# EAGLE schematic project_full_hardware (EAGLE 8.2.1)
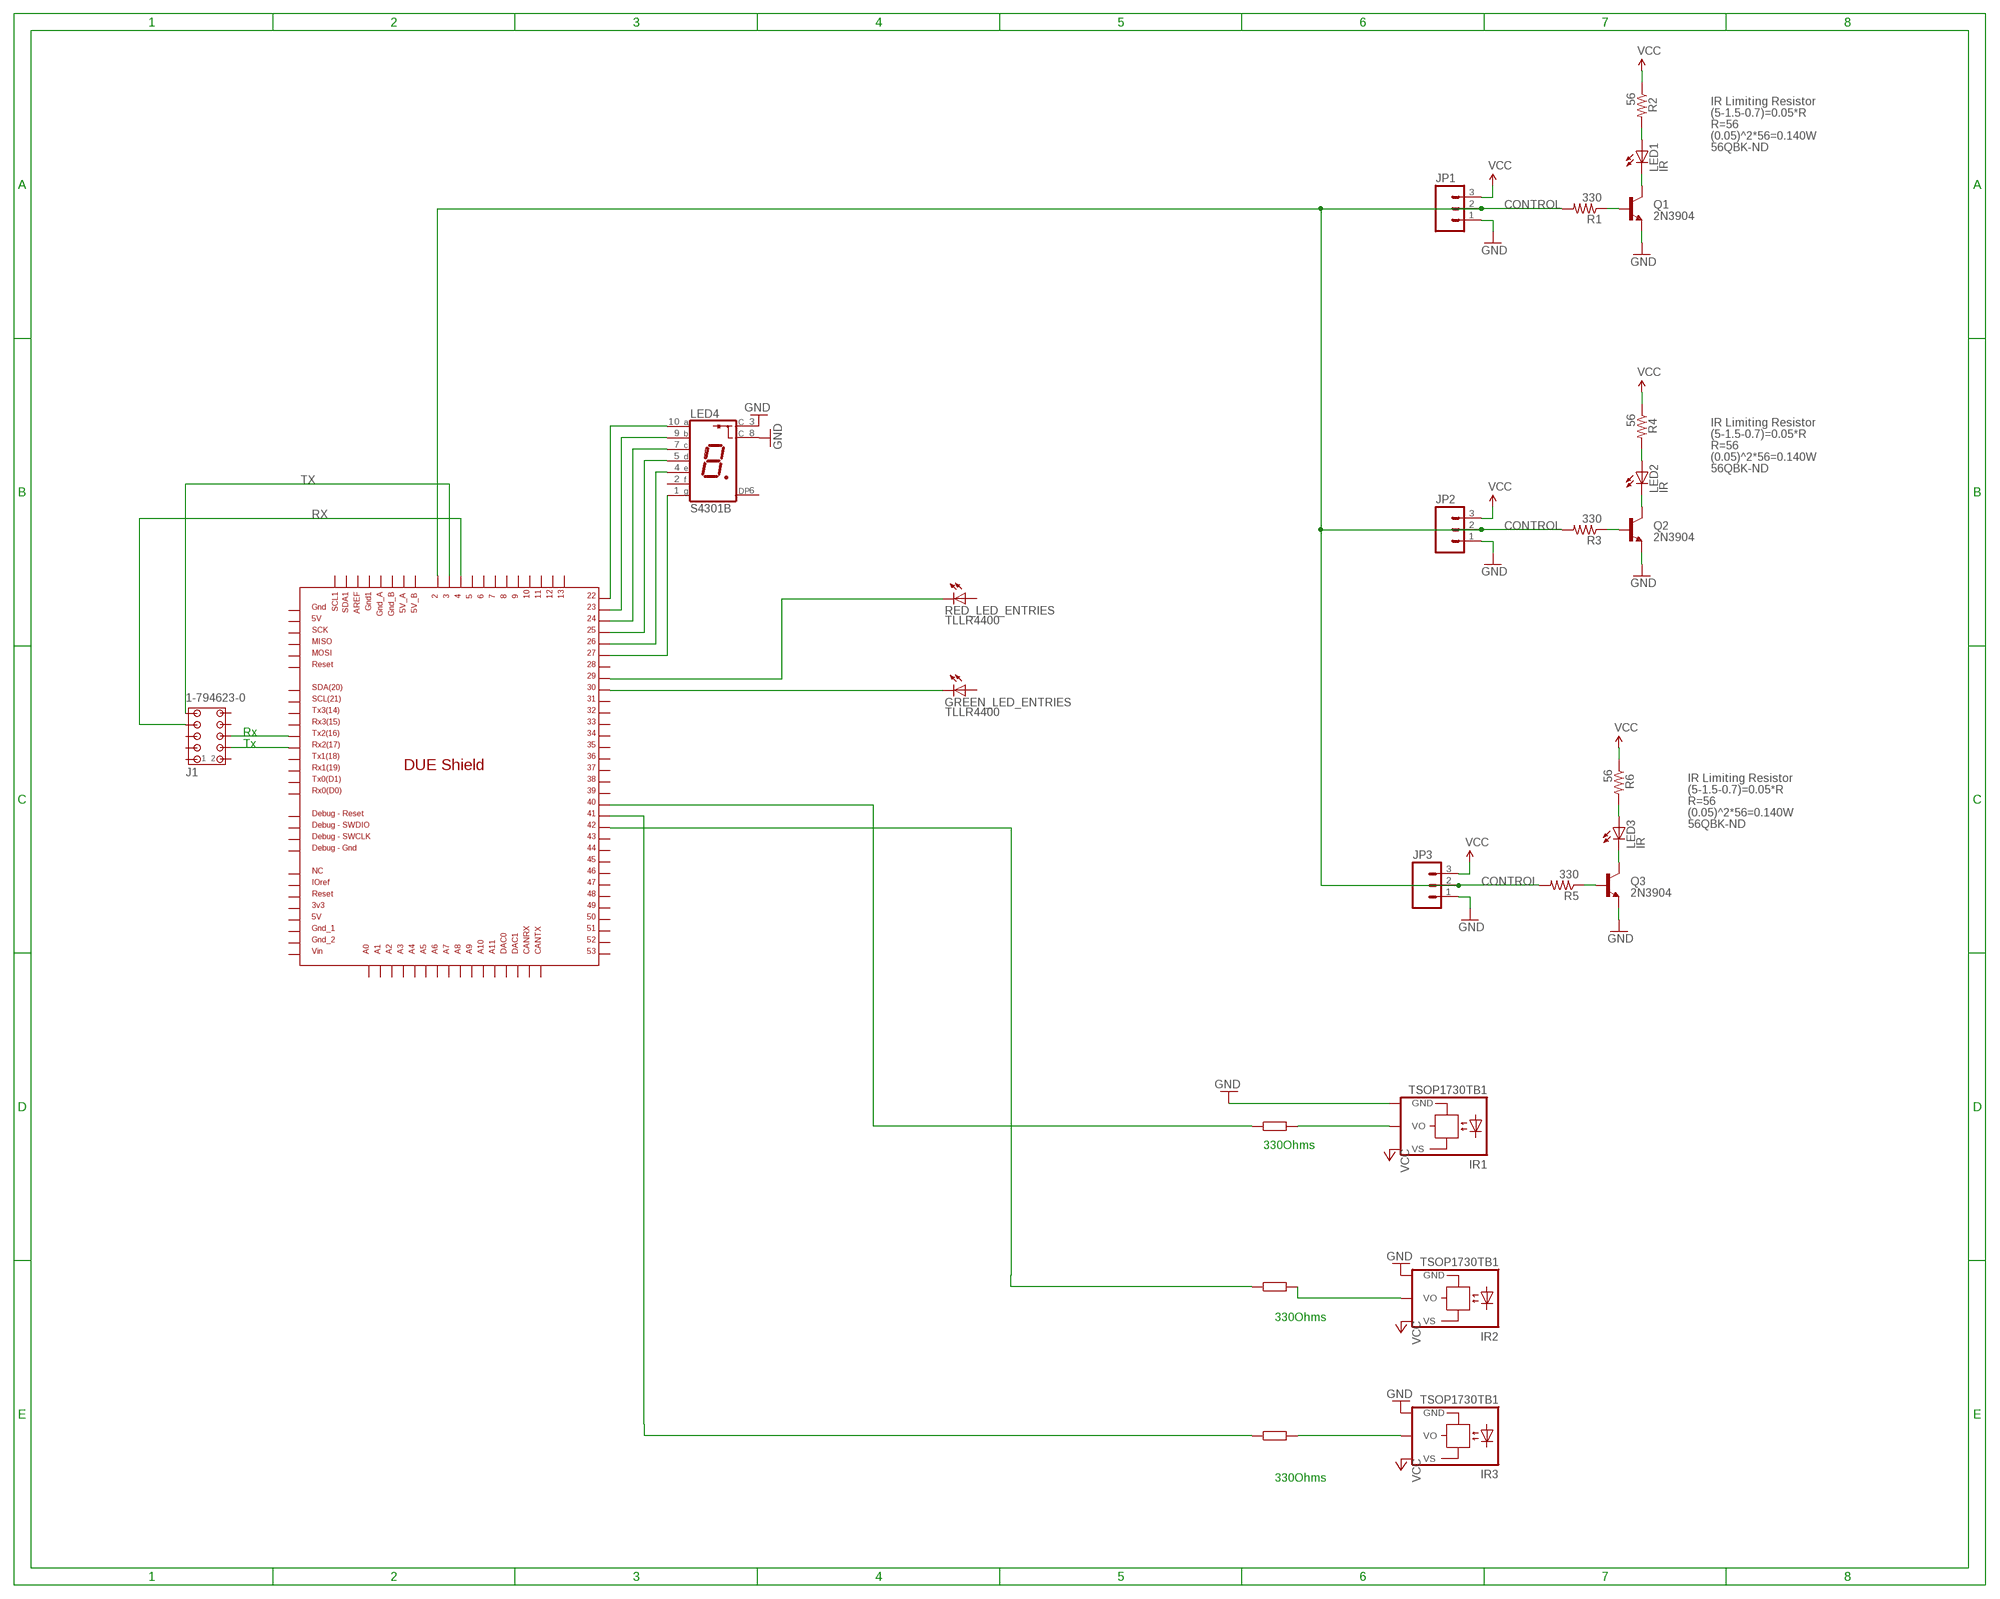
[diagram p0: schematic, sheet 1]

## Parts
GREEN_LED_ENTRIES  TLLR4400  [LED3MM]
IR1  TSOP1730TB1  [TSOP17_TB1]
IR2  TSOP1730TB1  [TSOP17_TB1]
IR3  TSOP1730TB1  [TSOP17_TB1]
J1  1-794623-0  [1-794623-0]
JP1  M03PTH  [1X03]
JP2  M03PTH  [1X03]
JP3  M03PTH  [1X03]
LED1  IR  LED5MM  [LED5MM]
LED2  IR  LED5MM  [LED5MM]
LED3  IR  LED5MM  [LED5MM]
LED4  S4301B  [S4301B]
Q1  2N3904  TRANSISTOR_NPNTO92  [TO-92]
Q2  2N3904  TRANSISTOR_NPNTO92  [TO-92]
Q3  2N3904  TRANSISTOR_NPNTO92  [TO-92]
R1  330  RESISTORAXIAL-0.3  [AXIAL-0.3]
R2  56  RESISTORAXIAL-0.3  [AXIAL-0.3]
R3  330  RESISTORAXIAL-0.3  [AXIAL-0.3]
R4  56  RESISTORAXIAL-0.3  [AXIAL-0.3]
R5  330  RESISTORAXIAL-0.3  [AXIAL-0.3]
R6  56  RESISTORAXIAL-0.3  [AXIAL-0.3]
RED_LED_ENTRIES  TLLR4400  [LED3MM]
U$1  DUE(NORMAL)  [DUE(NORMAL)]

## Nets
CONTROL: JP1.2 JP2.2 JP3.2 R1.P$2 R3.P$2 R5.P$2 U$1.2
GND: IR1.GND IR2.GND IR3.GND JP1.1 JP2.1 JP3.1 LED4.3(C) LED4.8(C) Q1.1(E) Q2.1(E) Q3.1(E)
N$1: LED1.K(C) Q1.3(C)
N$2: Q1.2(B) R1.P$1
N$3: Q2.2(B) R3.P$1
N$4: LED2.A R4.P$2
N$5: LED1.A R2.P$2
N$6: LED2.K(C) Q2.3(C)
N$7: Q3.2(B) R5.P$1
N$8: LED3.A R6.P$2
N$9: LED3.K(C) Q3.3(C)
N$10: RED_LED_ENTRIES.K(C) U$1.29
N$11: GREEN_LED_ENTRIES.K(C) U$1.30
N$12: U$1.40
N$13: U$1.42
N$15: U$1.41
N$17: LED4.10(A) U$1.22
N$18: LED4.9(B) U$1.23
N$19: LED4.7(C) U$1.24
N$20: LED4.5(D) U$1.25
N$21: LED4.4(E) U$1.26
N$22: LED4.1(G) U$1.27
N$23: IR2.VO
N$24: IR1.VO
N$25: IR3.VO
RX: J1.6 J1.7 U$1.4 U$1.TX2
TX: J1.4 J1.9 U$1.3 U$1.RX2
VCC [vcc]: IR1.VS IR2.VS IR3.VS JP1.3 JP2.3 JP3.3 R2.P$1 R4.P$1 R6.P$1
Unconnected: GREEN_LED_ENTRIES.A J1.1 J1.2 J1.3 J1.5 J1.8 J1.10 LED4.2(F) LED4.6(DP) RED_LED_ENTRIES.A U$1.3V3 U$1.5 U$1.5V U$1.5V_A U$1.5V_B U$1.5V_ICSP U$1.6 U$1.7 U$1.8 U$1.9 U$1.10 U$1.11 U$1.12 U$1.13 U$1.28 U$1.31 U$1.32 U$1.33 U$1.34 U$1.35 U$1.36 U$1.37 U$1.38 U$1.39 U$1.43 U$1.44 U$1.45 U$1.46 U$1.47 U$1.48 U$1.49 U$1.50 U$1.51 U$1.52 U$1.53 U$1.A0 U$1.A1 U$1.A2 U$1.A3 U$1.A4 U$1.A5 U$1.A6 U$1.A7 U$1.A8 U$1.A9 U$1.A10 U$1.A11 U$1.AREF U$1.CANRX U$1.CANTX U$1.DAC0 U$1.DAC1 U$1.GND1 U$1.GND_1 U$1.GND_2 U$1.GND_A U$1.GND_B U$1.GND_DEBUG U$1.GND_ICSP U$1.IOREF U$1.MISO_ICSP U$1.MOSI_ICSP U$1.NC U$1.RESET U$1.RESET_DEBUG U$1.RESET_ICSP U$1.RX0 U$1.RX1 U$1.RX3 U$1.SCK_ICSP U$1.SCL U$1.SCL1 U$1.SDA U$1.SDA1 U$1.SWCLK_DEBUG U$1.SWDIO_DEBUG U$1.TX0 U$1.TX1 U$1.TX3 U$1.VIN

## Notes on the sheet
- IR Limiting Resistor
- (5-1.5-0.7)=0.05*R
- R=56
- (0.05)^2*56=0.140W
- 56QBK-ND
- IR Limiting Resistor
- (5-1.5-0.7)=0.05*R
- R=56
- (0.05)^2*56=0.140W
- 56QBK-ND
- Rx
- Tx
- IR Limiting Resistor
- (5-1.5-0.7)=0.05*R
- R=56
- (0.05)^2*56=0.140W
- 56QBK-ND
- 330Ohms
- 330Ohms
- 330Ohms

## Library data of the parts
GREEN_LED_ENTRIES RED_LED_ENTRIES = led:TLLR4400: Low Current (2mA) LED 3 mm Tinted Diffused Package color RED Source: Data sheet <http://www.farnell.com/datasheets/391100.pdf>; MF: VISHAY SEMICONDUCTOR; OC_FARNELL: 1612437
IR1-IR3 = telefunken:TSOP17*TB1: TSOP17..TB1 IR Receiver Modules for Remote Control Systems Source: http://www.vishay.com/docs/82042/82042.pdf; OC_FARNELL: unknown; OC_NEWARK: unknown
J1 = con-amp:1-794623-0: MICRO MATE N LOK Dual Row, grid 1.5 mm Source: http://catalog.tycoelectronics.com .. ENG_CD_794623_F.pdf
JP1-JP3 = SparkFun:M03: Header 3 Standard 3-pin 0.1" header. Use with straight break away headers (SKU : PRT-00116), right angle break away headers (PRT-00553), swiss pins (PRT-00743), machine pins (PRT-00117), and female headers (PRT-00115). Molex polarized connector foot print use with SKU : PRT-08232 with associated crimp pins and housings.
LED1-LED3 = SparkFun:LED: LEDs Standard schematic elements and footprints for 5mm, 3mm, 1206, and 0603 sized LEDs. 5mm - Spark Fun Electronics SKU : COM-00529 (and others)
LED4 = led-7-segment:S4301B: Single Digit Seven-Segment Display (cathode common) Source: LITEON .. S4301B.pdf; OC_FARNELL: unknown; OC_NEWARK: unknown
Q1-Q3 = SparkFun:TRANSISTOR_NPN: Transistor NPN BJT configuration in SOT23 package. MMBT2222 is the common NPN we use. Double check BCE configuration again layout.
R1-R6 = SparkFun:RESISTOR: Resistor Basic schematic elements and footprints for 0603, 1206, and PTH resistors.
U$1 = DUElib130425:DUE(NORMAL)

## Net classes
1 vcc: width 0.254 mm